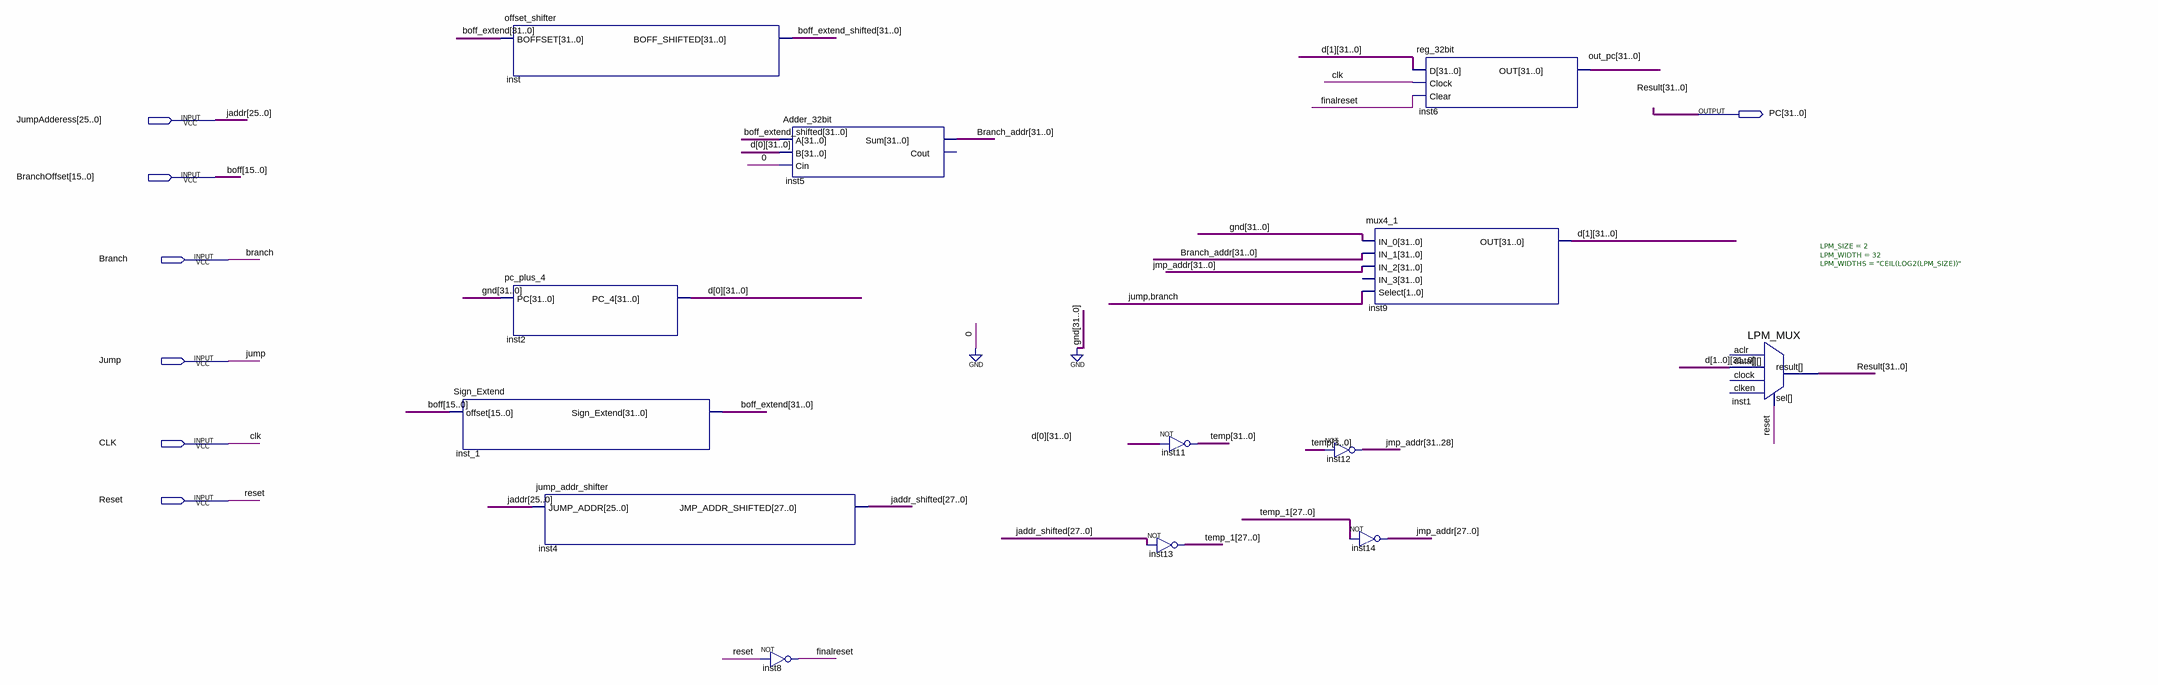
[diagram p0: schematic sheet]
// Quartus schematic PC.bdf as structural Verilog: 13 symbols, 7 pins
module PC (
  input  [25:0] JumpAdderess,
  input  [15:0] BranchOffset,
  input  Branch,
  input  Jump,
  input  CLK,
  input  Reset,
  output [31:0] PC
);

  wire finalreset;
  wire [27:0] jaddr_shifted, temp_1;
  wire [31:0] boff_extend, boff_extend_shifted, Branch_addr, d_0, d_1, jmp_addr, out_pc, temp;

  Sign_Extend inst_1 (.offset(BranchOffset), .Sign_Extend(boff_extend));
  offset_shifter inst (.BOFFSET(boff_extend), .BOFF_SHIFTED(boff_extend_shifted));
  pc_plus_4 inst2 (.PC({32{1'b0}}), .PC_4(d_0));
  jump_addr_shifter inst4 (.JUMP_ADDR(JumpAdderess), .JMP_ADDR_SHIFTED(jaddr_shifted));
  Adder_32bit inst5 (.A(boff_extend_shifted), .B(d_0), .Cin(1'b0), .Sum(Branch_addr));  // open: Cout
  not inst8 (finalreset, Reset);
  assign temp_1 = ~jaddr_shifted;  // NOT inst13, 28 bits wide
  assign temp = ~d_0;  // NOT inst11, 32 bits wide
  assign jmp_addr[31:28] = ~temp[3:0];  // NOT inst12, 4 bits wide
  assign jmp_addr[27:0] = ~temp_1;  // NOT inst14, 28 bits wide
  mux4_1 inst9 (
    .IN_0({32{1'b0}}), .IN_1(Branch_addr), .IN_2(jmp_addr), .Select({Jump, Branch}), .OUT(d_1));  // open: IN_3
  reg_32bit inst6 (.D(d_1), .Clock(CLK), .Clear(finalreset), .OUT(out_pc));
  LPM_MUX #(.LPM_SIZE(2), .LPM_WIDTH(32), .LPM_WIDTHS("CEIL(LOG2(LPM_SIZE))")) inst1 (
    .data({d_1, d_0}), .sel(Reset), .result(PC));  // open: clock, aclr, clken

  // Other names for the same wires on the sheet: boff[15:0] = BranchOffset; jaddr[25:0] = JumpAdderess;
  //   Result[31:0] = PC
endmodule
